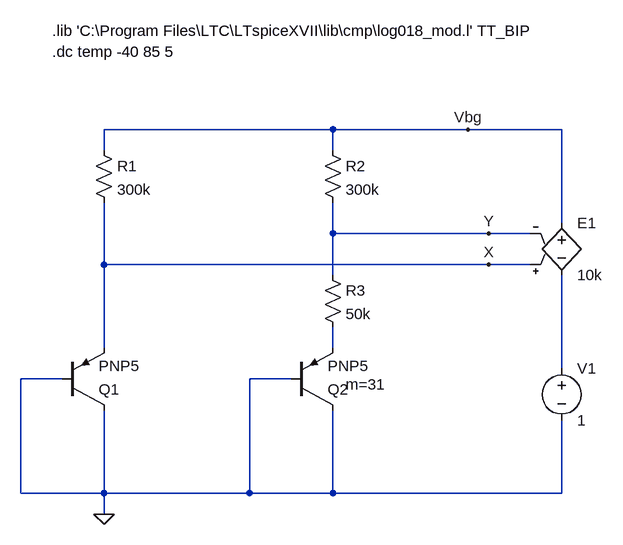
[diagram p0: schematic E3_BJT_Bandgap.asc]
E3_BJT_Bandgap.asc, the LTspice schematic file:
Version 4
SHEET 1 2248 788
WIRE 992 176 640 176
WIRE 1200 176 992 176
WIRE 1344 176 1200 176
WIRE 640 208 640 176
WIRE 992 208 992 176
WIRE 1344 320 1344 176
WIRE 992 336 992 288
WIRE 1232 336 992 336
WIRE 1296 336 1232 336
WIRE 640 384 640 288
WIRE 1232 384 640 384
WIRE 1296 384 1232 384
WIRE 992 400 992 336
WIRE 640 512 640 384
WIRE 992 512 992 480
WIRE 1344 544 1344 400
WIRE 576 560 512 560
WIRE 928 560 864 560
WIRE 512 736 512 560
WIRE 640 736 640 608
WIRE 640 736 512 736
WIRE 864 736 864 560
WIRE 864 736 640 736
WIRE 992 736 992 608
WIRE 992 736 864 736
WIRE 1344 736 1344 624
WIRE 1344 736 992 736
WIRE 640 768 640 736
FLAG 640 768 0
FLAG 1232 336 Y
FLAG 1232 384 X
FLAG 1200 176 Vbg
SYMBOL pnp2 576 608 M180
SYMATTR InstName Q1
SYMATTR Value PNP5
SYMBOL pnp2 928 608 M180
WINDOW 123 84 40 Left 2
SYMATTR Value2 m=31
SYMATTR InstName Q2
SYMATTR Value PNP5
SYMBOL res 624 192 R0
SYMATTR InstName R1
SYMATTR Value 300k
SYMBOL res 976 192 R0
SYMATTR InstName R2
SYMATTR Value 300k
SYMBOL res 976 384 R0
SYMATTR InstName R3
SYMATTR Value 50k
SYMBOL e2 1344 304 R0
SYMATTR InstName E1
SYMATTR Value 10k
SYMBOL voltage 1344 528 R0
WINDOW 123 0 0 Left 0
WINDOW 39 0 0 Left 0
SYMATTR InstName V1
SYMATTR Value 1
TEXT 560 56 Left 2 !.dc temp -40 85 5
TEXT 560 24 Left 2 !.lib 'C:\\Program Files\\LTC\\LTspiceXVII\\lib\\cmp\\log018_mod.l' TT_BIP

The netlist it stands for:
* E3_BJT_Bandgap.asc
Q1 0 0 X 0 PNP5
Q2 0 0 N001 0 PNP5 m=31
R1 Vbg X 300k
R2 Vbg Y 300k
R3 Y N001 50k
E1 Vbg N002 X Y 10k
V1 N002 0 1
.model NPN NPN
.model PNP PNP
.lib standard.bjt
.dc temp -40 85 5
.lib 'C:\Program Files\LTC\LTspiceXVII\lib\cmp\log018_mod.l' TT_BIP
.backanno
.end